# EAGLE schematic Chassis Board (EAGLE 9.1.3)
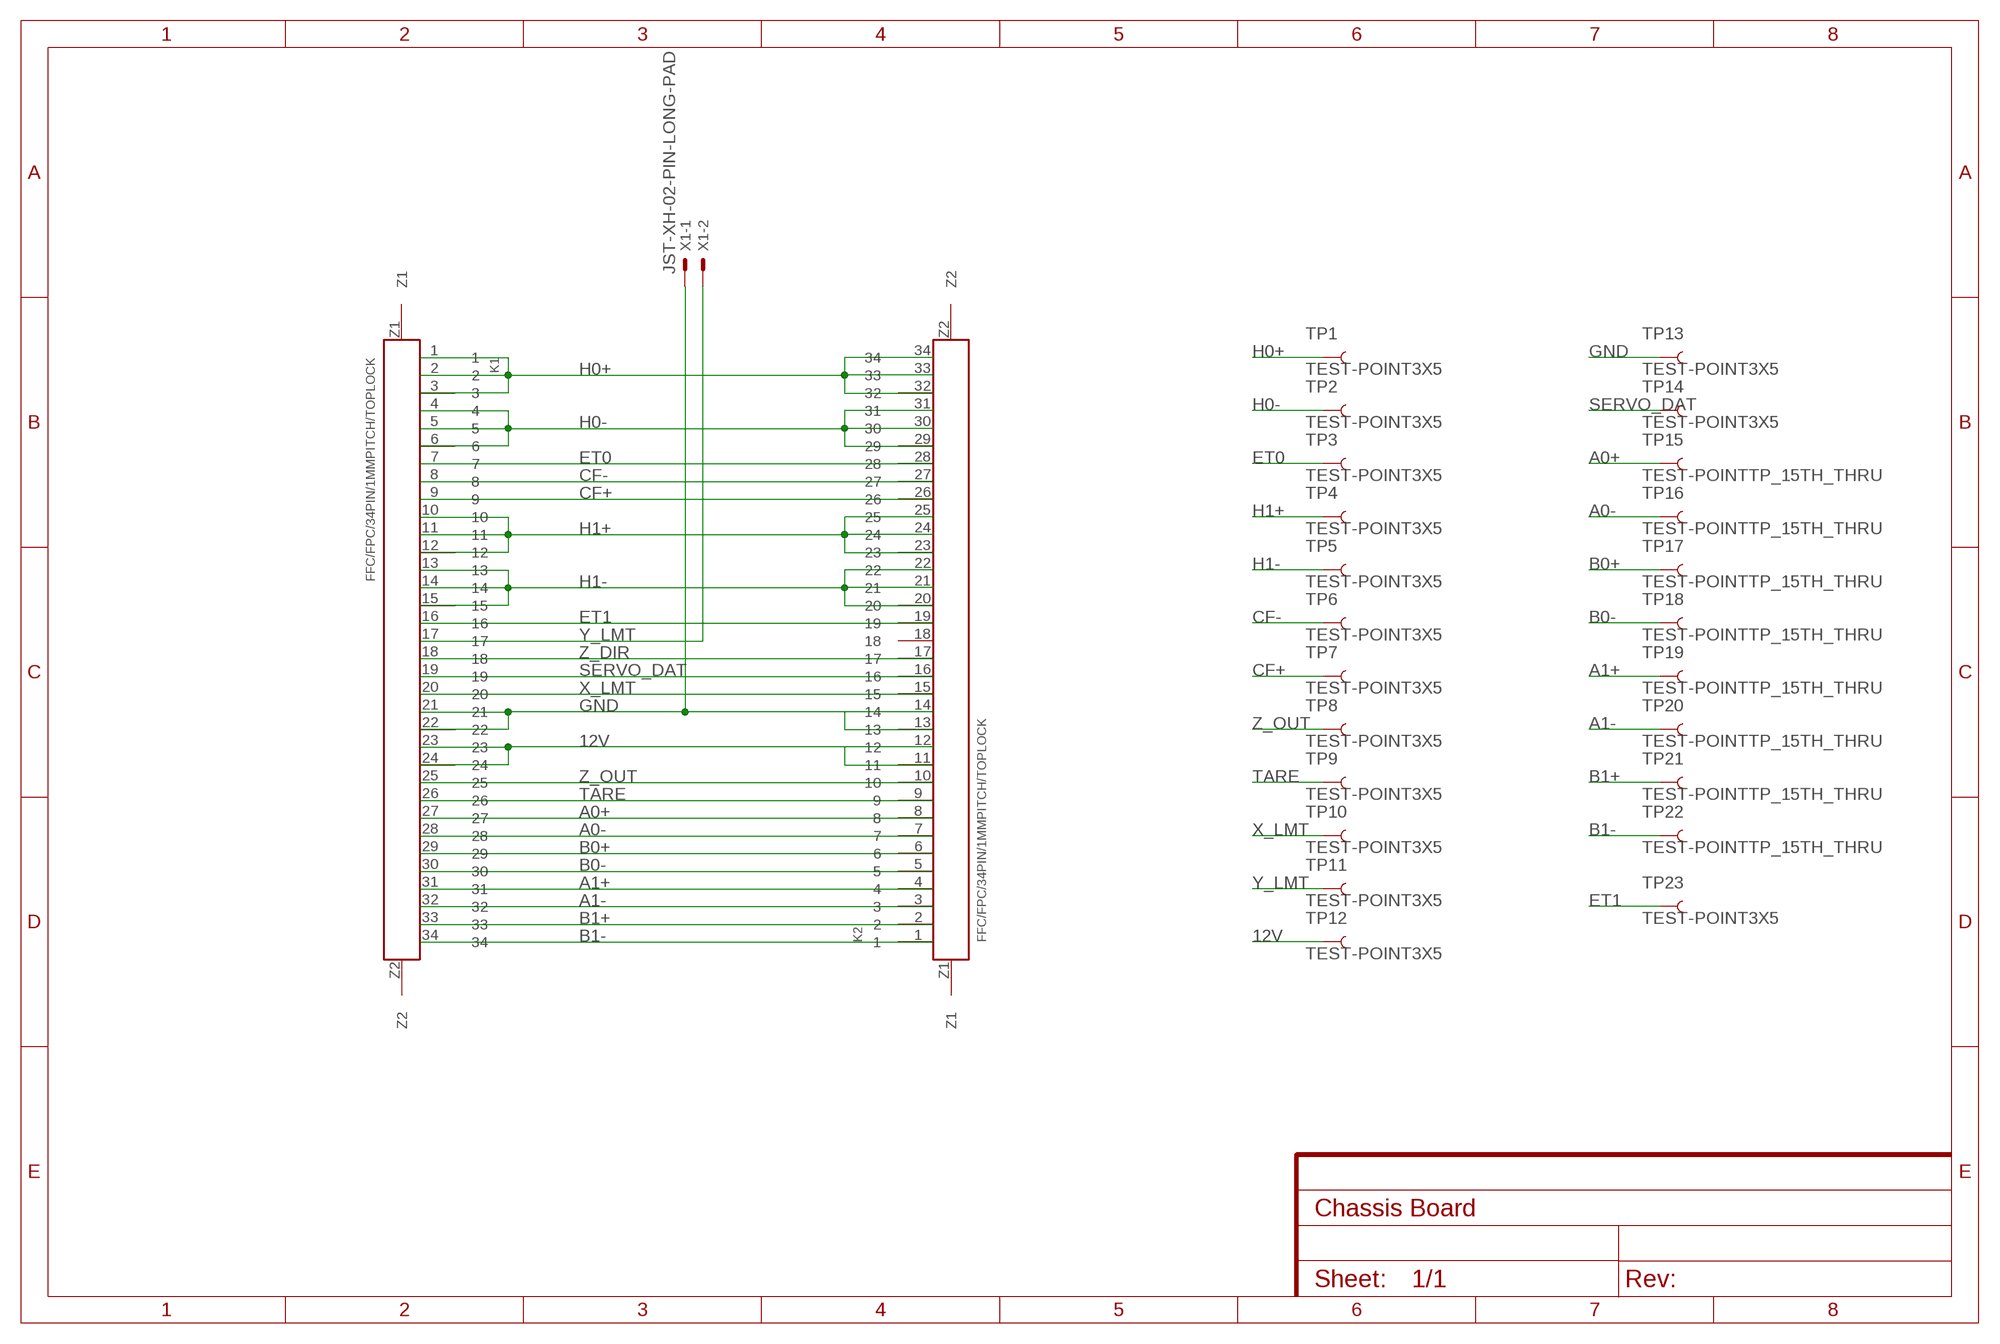
[diagram p0: schematic, sheet 1]

## Parts
K1  FFC/FPC/34PIN/1MMPITCH/TOPLOCK  [34PIN/1MMPITCH/FFC/FPC]
K2  FFC/FPC/34PIN/1MMPITCH/TOPLOCK  [34PIN/1MMPITCH/FFC/FPC]
TP1  TEST-POINT3X5  [PAD.03X.05]
TP2  TEST-POINT3X5  [PAD.03X.05]
TP3  TEST-POINT3X5  [PAD.03X.05]
TP4  TEST-POINT3X5  [PAD.03X.05]
TP5  TEST-POINT3X5  [PAD.03X.05]
TP6  TEST-POINT3X5  [PAD.03X.05]
TP7  TEST-POINT3X5  [PAD.03X.05]
TP8  TEST-POINT3X5  [PAD.03X.05]
TP9  TEST-POINT3X5  [PAD.03X.05]
TP10  TEST-POINT3X5  [PAD.03X.05]
TP11  TEST-POINT3X5  [PAD.03X.05]
TP12  TEST-POINT3X5  [PAD.03X.05]
TP13  TEST-POINT3X5  [PAD.03X.05]
TP14  TEST-POINT3X5  [PAD.03X.05]
TP15  TEST-POINTTP_15TH_THRU  [TP_15TH]
TP16  TEST-POINTTP_15TH_THRU  [TP_15TH]
TP17  TEST-POINTTP_15TH_THRU  [TP_15TH]
TP18  TEST-POINTTP_15TH_THRU  [TP_15TH]
TP19  TEST-POINTTP_15TH_THRU  [TP_15TH]
TP20  TEST-POINTTP_15TH_THRU  [TP_15TH]
TP21  TEST-POINTTP_15TH_THRU  [TP_15TH]
TP22  TEST-POINTTP_15TH_THRU  [TP_15TH]
TP23  TEST-POINT3X5  [PAD.03X.05]
X1  JST-XH-02-PIN-LONG-PAD  [JST-XH-02-PACKAGE-LONG-PAD]

## Nets
12V: K1.23 K1.24 K2.11 K2.12 TP12.P$1
A0+: K1.27 K2.8 TP15.P$1
A0-: K1.28 K2.7 TP16.P$1
A1+: K1.31 K2.4 TP19.P$1
A1-: K1.32 K2.3 TP20.P$1
B0+: K1.29 K2.6 TP17.P$1
B0-: K1.30 K2.5 TP18.P$1
B1+: K1.33 K2.2 TP21.P$1
B1-: K1.34 K2.1 TP22.P$1
CF+: K1.9 K2.26 TP7.P$1
CF-: K1.8 K2.27 TP6.P$1
ET0: K1.7 K2.28 TP3.P$1
ET1: K1.16 K2.19 TP23.P$1
GND: K1.21 K1.22 K2.13 K2.14 TP13.P$1 X1.1
H0+: K1.1 K1.2 K1.3 K2.32 K2.33 K2.34 TP1.P$1
H0-: K1.4 K1.5 K1.6 K2.29 K2.30 K2.31 TP2.P$1
H1+: K1.10 K1.11 K1.12 K2.23 K2.24 K2.25 TP4.P$1
H1-: K1.13 K1.14 K1.15 K2.20 K2.21 K2.22 TP5.P$1
SERVO_DAT: K1.19 K2.16 TP14.P$1
TARE: K1.26 K2.9 TP9.P$1
X_LMT: K1.20 K2.15 TP10.P$1
Y_LMT: K1.17 TP11.P$1 X1.2
Z_DIR: K1.18 K2.17
Z_OUT: K1.25 K2.10 TP8.P$1
Unconnected: K1.Z1 K1.Z2 K2.18 K2.Z1 K2.Z2

## Library data of the parts
K1 K2 = FracktalWorks_Eagle_Library:FFC/FPC/34PIN/1MMPITCH/TOPLOCK
TP1-TP23 = SparkFun-Connectors:TEST-POINT: SparkFun Test Points Bare copper test points for troubleshooting or In-Circuit-Testing. These are used by our Production team for verifying production board runs using pogo-pins on test beds. SparkFun Products: SparkFun LSM9DS1 Breakout <https://www.sparkfun.com/products/13284> SparkFun PSOC <https://www.sparkfun.com/products/13714> SparkFun Load Cell Amplifier <https://www.sparkfun.com/products/13879>
X1 = Rembrandt Electronics - JST XH Connectors v1-0:JST-XH-02-PIN: JST XH Connector 2 Pin Wire to board connector. Pitch: 2,54 mm, (0.100") Number of pins: 2 Created by Rembrandt Electronics www.rembrandtelectronics.com